# Altium project th0nanoPC.PrjPcb
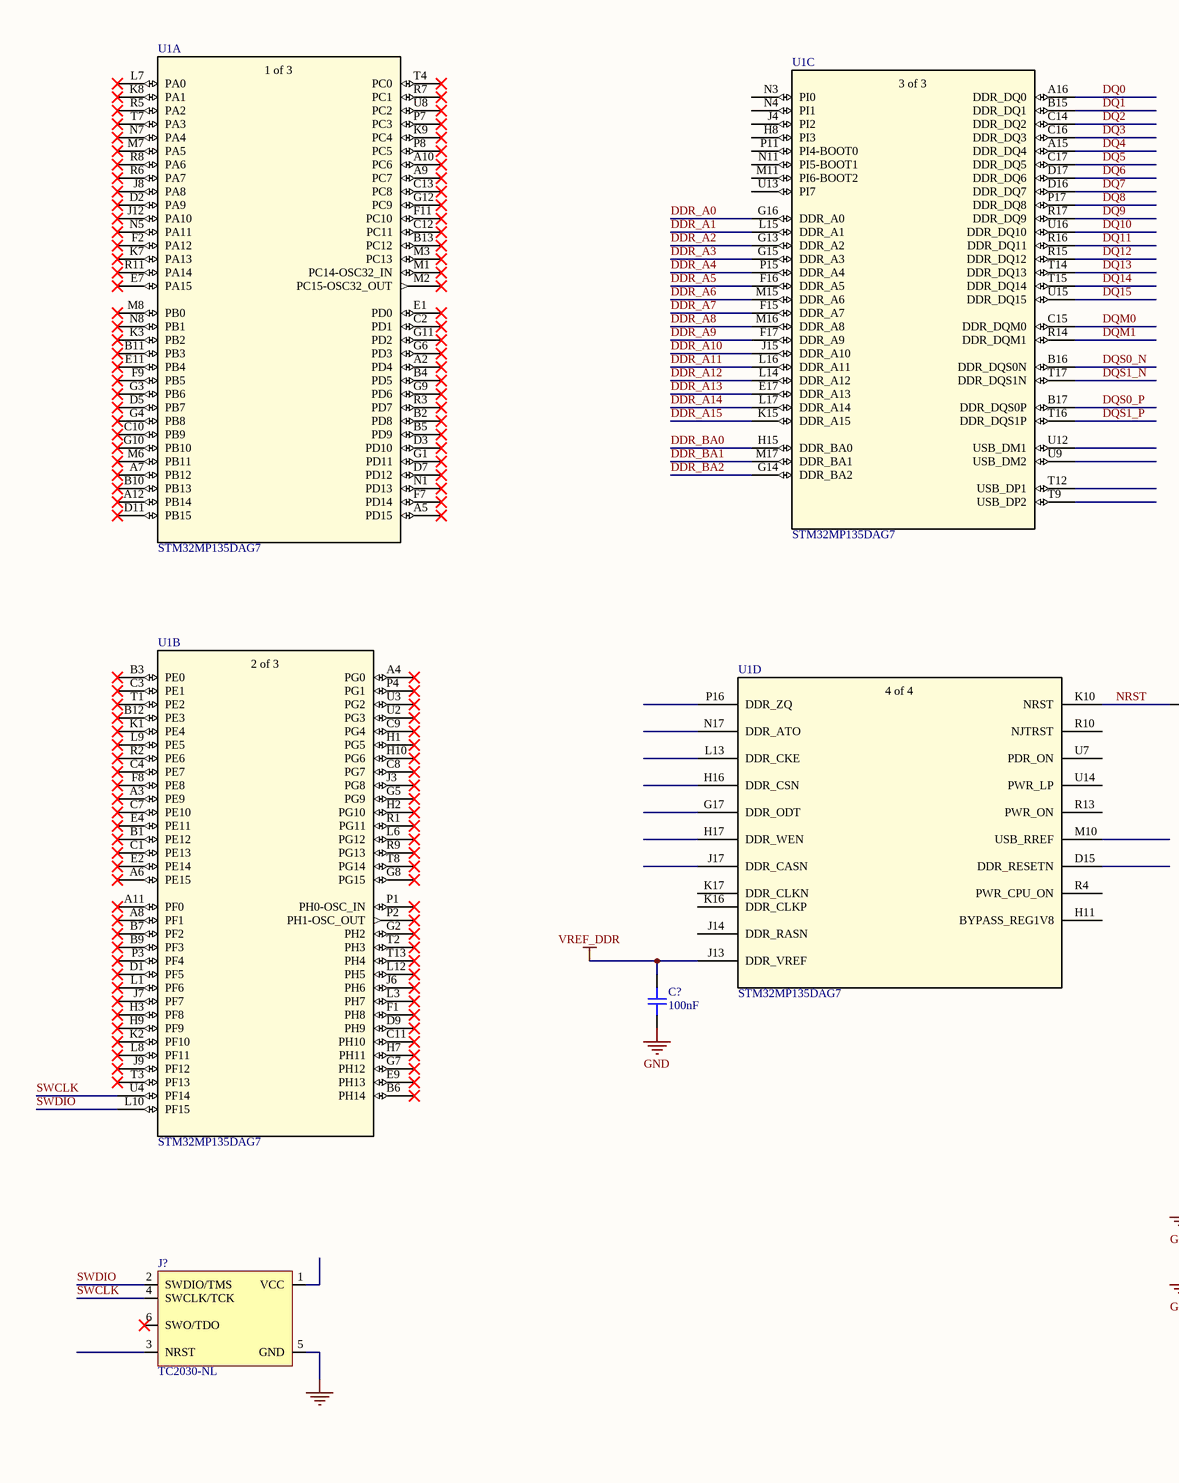
[diagram p0: core.SchDoc, left]
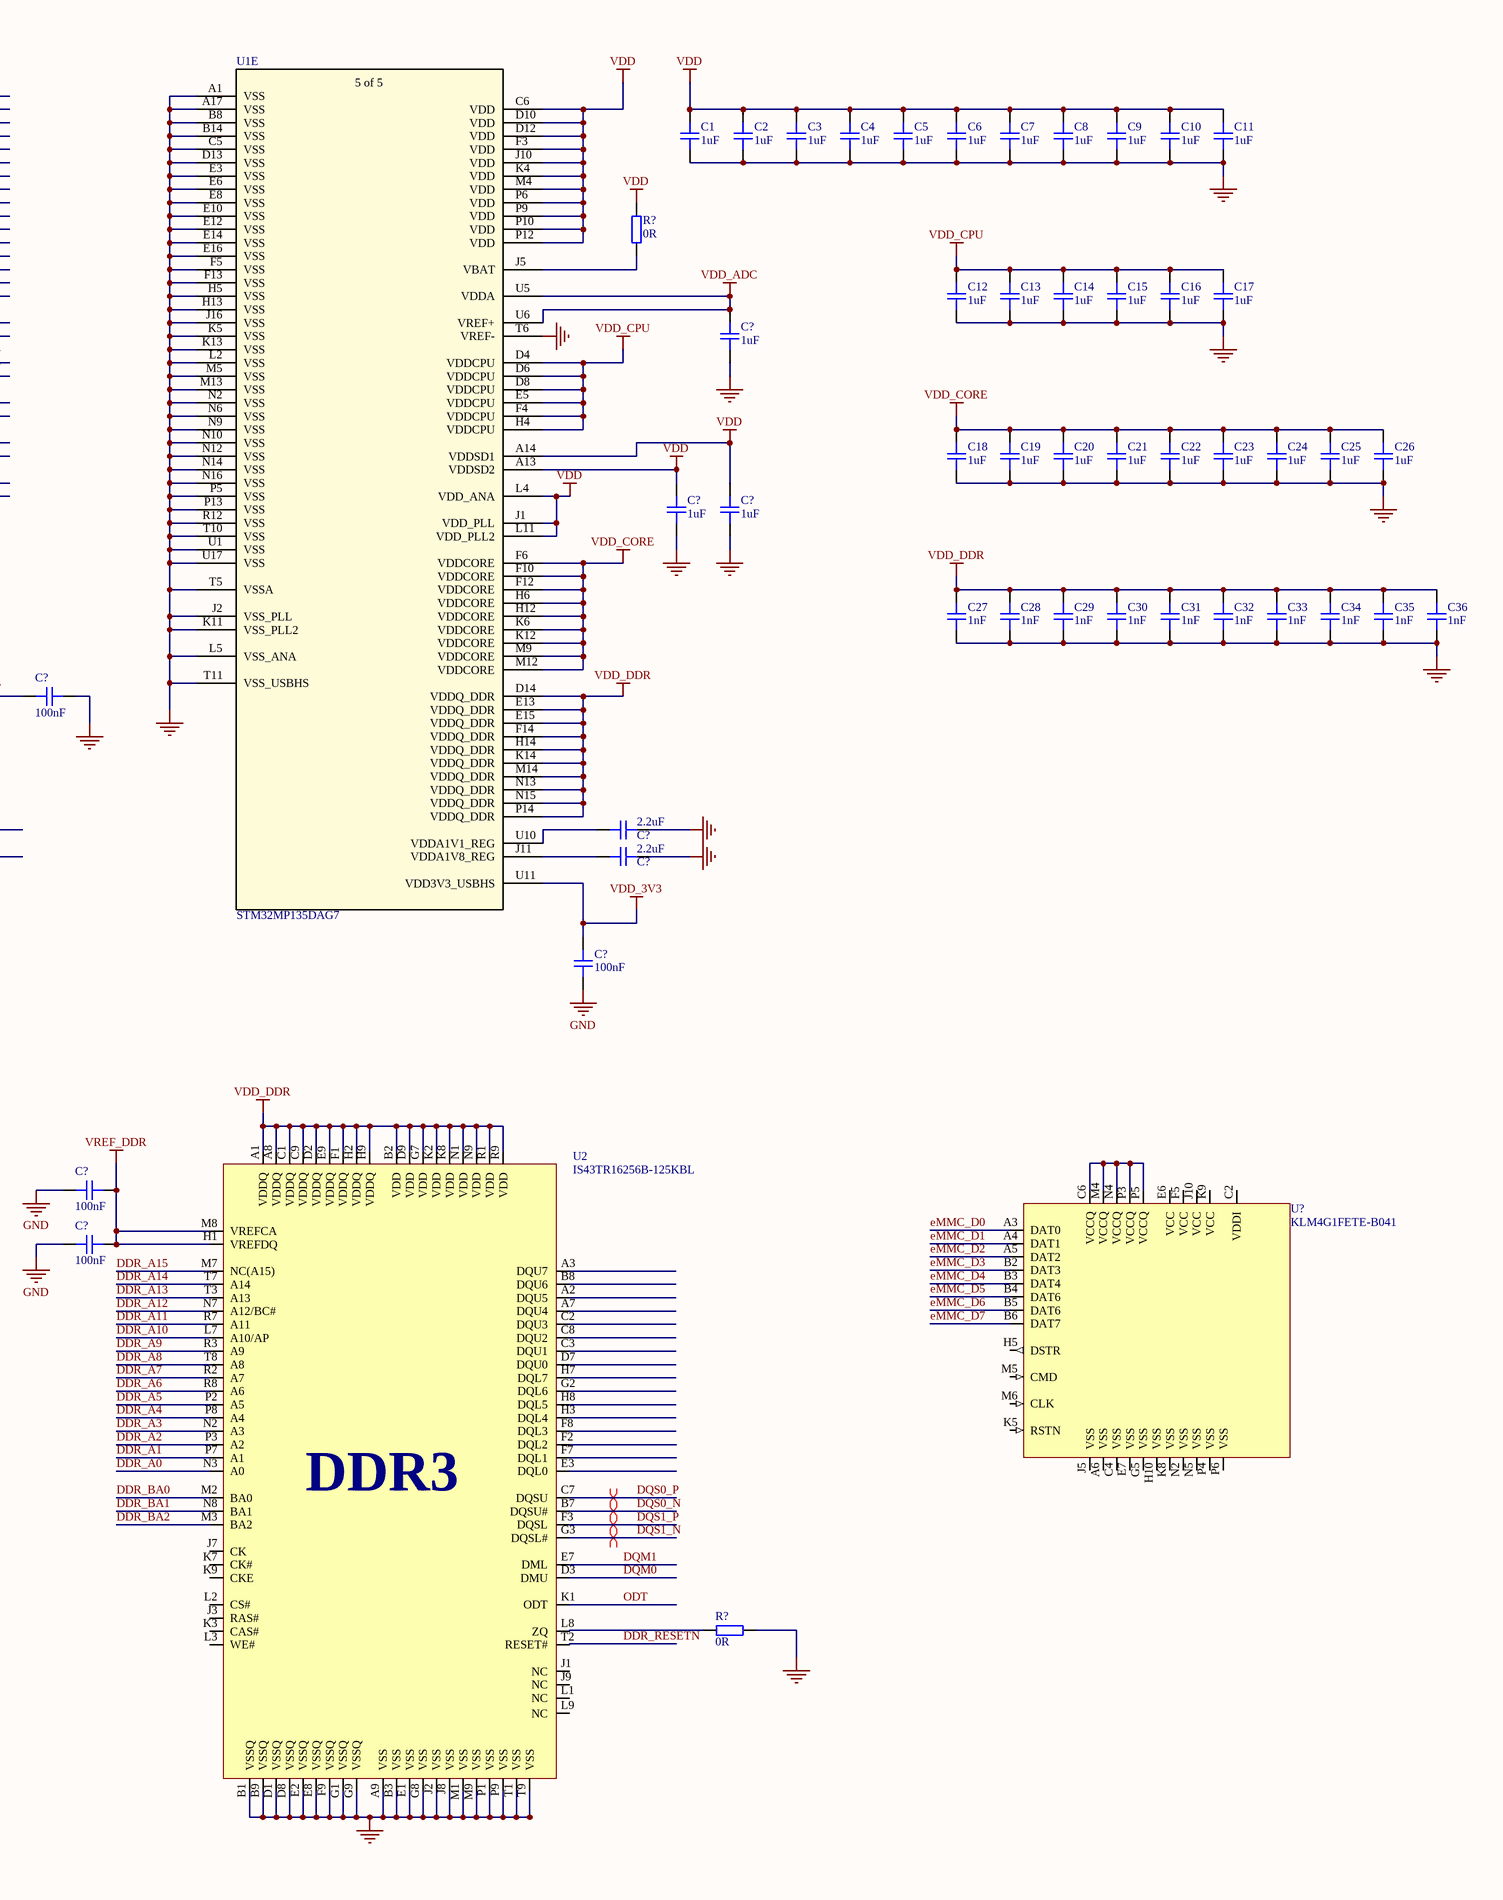
[diagram p1: core.SchDoc, right]
1 sheet, 52 parts. Net scope: global (net labels, ports and power ports of the same name join across sheets).
Board file: TH0A001.PcbDoc

## Sheet core.SchDoc
size A2; SheetNumber: 1; SheetTotal: 1

### Parts
(Parts that share a designator on the sheet are numbered #1, #2 ... from top to bottom, then left to right.)
C1  1uF  [CAP_0402]
C2  1uF  [CAP_0402]
C3  1uF  [CAP_0402]
C4  1uF  [CAP_0402]
C5  1uF  [CAP_0402]
C6  1uF  [CAP_0402]
C7  1uF  [CAP_0402]
C8  1uF  [CAP_0402]
C9  1uF  [CAP_0402]
C10  1uF  [CAP_0402]
C11  1uF  [CAP_0402]
C12  1uF  [CAP_0402]
C13  1uF  [CAP_0402]
C14  1uF  [CAP_0402]
C15  1uF  [CAP_0402]
C16  1uF  [CAP_0402]
C17  1uF  [CAP_0402]
C18  1uF  [CAP_0402]
C19  1uF  [CAP_0402]
C20  1uF  [CAP_0402]
C21  1uF  [CAP_0402]
C22  1uF  [CAP_0402]
C23  1uF  [CAP_0402]
C24  1uF  [CAP_0402]
C25  1uF  [CAP_0402]
C26  1uF  [CAP_0402]
C27  1nF  [CAP_0402]
C28  1nF  [CAP_0402]
C29  1nF  [CAP_0402]
C30  1nF  [CAP_0402]
C31  1nF  [CAP_0402]
C32  1nF  [CAP_0402]
C33  1nF  [CAP_0402]
C34  1nF  [CAP_0402]
C35  1nF  [CAP_0402]
C36  1nF  [CAP_0402]
C?#1  1uF  [CAP_0402]
C?#2  1uF  [CAP_0402]
C?#3  1uF  [CAP_0402]
C?#4  100nF  [CAP_0402]
C?#5  2.2uF  [CAP_0402]
C?#6  2.2uF  [CAP_0402]
C?#7  100nF  [CAP_0402]
C?#8  100nF  [CAP_0402]
C?#9  100nF  [CAP_0402]
C?#10  100nF  [CAP_0402]
J?  TC2030-NL  [TC2030-NL-FP]  (no BOM)
R?#1  0R  [RES_0402]
R?#2  0R  [RES_0402]
U1  STM32MP135DAG7  [TFBGA289_STM]  (parts A,B,C,D,E of 5)
U2  IS43TR16256B-125KBL  [BGA96C80P9X16_900X1300X120]
U?  KLM4G1FETE-B041  [FBGA-153-11X10X0MM8]

### Nets
GND: C1.1 C2.1 C3.1 C4.1 C5.1 C6.1 C7.1 C8.1 C9.1 C10.1 C11.1 C12.1 C13.1 C14.1 C15.1 C16.1 C17.1 C18.1 C19.1 C20.1 C21.1 C22.1 C23.1 C24.1 C25.1 C26.1 C27.1 C28.1 C29.1 C30.1 C31.1 C32.1 C33.1 C34.1 C35.1 C36.1 C?#1.1 C?#2.1 C?#3.1 C?#4.1 C?#5.1 C?#6.1 C?#7.1 C?#8.2 C?#9.2 C?#10.2 J?.5(GND) R?#2.1 U1.A1(VSS) U1.A17(VSS) U1.B8(VSS) U1.B14(VSS) U1.C5(VSS) U1.D13(VSS) U1.E3(VSS) U1.E6(VSS) U1.E8(VSS) U1.E10(VSS) U1.E12(VSS) U1.E14(VSS) U1.E16(VSS) U1.F5(VSS) U1.F13(VSS) U1.H5(VSS) U1.H13(VSS) U1.J2(VSS_PLL) U1.J16(VSS) U1.K5(VSS) U1.K11(VSS_PLL2) U1.K13(VSS) U1.L2(VSS) U1.L5(VSS_ANA) U1.M5(VSS) U1.M13(VSS) U1.N2(VSS) U1.N6(VSS) U1.N9(VSS) U1.N10(VSS) U1.N12(VSS) U1.N14(VSS) U1.N16(VSS) U1.P5(VSS) U1.P13(VSS) U1.R12(VSS) U1.T5(VSSA) U1.T6(VREF-) U1.T10(VSS) U1.T11(VSS_USBHS) U1.U1(VSS) U1.U17(VSS) U2.A9(VSS) U2.B1(VSSQ) U2.B3(VSS) U2.B9(VSSQ) U2.D1(VSSQ) U2.D8(VSSQ) U2.E1(VSS) U2.E2(VSSQ) U2.E8(VSSQ) U2.F9(VSSQ) U2.G1(VSSQ) U2.G8(VSS) U2.G9(VSSQ) U2.J2(VSS) U2.J8(VSS) U2.M1(VSS) U2.M9(VSS) U2.P1(VSS) U2.P9(VSS) U2.T1(VSS) U2.T9(VSS)
VDD: C1.2 C2.2 C3.2 C4.2 C5.2 C6.2 C7.2 C8.2 C9.2 C10.2 C11.2 C?#2.2 C?#3.2 R?#1.2 U1.A13(VDDSD2) U1.A14(VDDSD1) U1.C6(VDD) U1.D10(VDD) U1.D12(VDD) U1.F3(VDD) U1.J1(VDD_PLL) U1.J10(VDD) U1.K4(VDD) U1.L4(VDD_ANA) U1.L11(VDD_PLL2) U1.M4(VDD) U1.P6(VDD) U1.P9(VDD) U1.P10(VDD) U1.P12(VDD)
VDD_3V3: C?#7.2 U1.U11(VDD3V3_USBHS)
VDD_ADC: C?#1.2 U1.U5(VDDA) U1.U6(VREF+)
VDD_CORE: C18.2 C19.2 C20.2 C21.2 C22.2 C23.2 C24.2 C25.2 C26.2 U1.F6(VDDCORE) U1.F10(VDDCORE) U1.F12(VDDCORE) U1.H6(VDDCORE) U1.H12(VDDCORE) U1.K6(VDDCORE) U1.K12(VDDCORE) U1.M9(VDDCORE) U1.M12(VDDCORE)
VDD_CPU: C12.2 C13.2 C14.2 C15.2 C16.2 C17.2 U1.D4(VDDCPU) U1.D6(VDDCPU) U1.D8(VDDCPU) U1.E5(VDDCPU) U1.F4(VDDCPU) U1.H4(VDDCPU)
VDD_DDR: C27.2 C28.2 C29.2 C30.2 C31.2 C32.2 C33.2 C34.2 C35.2 C36.2 U1.D14(VDDQ_DDR) U1.E13(VDDQ_DDR) U1.E15(VDDQ_DDR) U1.F14(VDDQ_DDR) U1.H14(VDDQ_DDR) U1.K14(VDDQ_DDR) U1.M14(VDDQ_DDR) U1.N13(VDDQ_DDR) U1.N15(VDDQ_DDR) U1.P14(VDDQ_DDR) U2.A1(VDDQ) U2.A8(VDDQ) U2.B2(VDD) U2.C1(VDDQ) U2.C9(VDDQ) U2.D2(VDDQ) U2.D9(VDD) U2.E9(VDDQ) U2.F1(VDDQ) U2.G7(VDD) U2.H2(VDDQ) U2.H9(VDDQ) U2.K2(VDD) U2.K8(VDD) U2.N1(VDD) U2.N9(VDD) U2.R1(VDD) U2.R9(VDD)
VREF_DDR: C?#8.1 C?#9.1 C?#10.1 U1.J13(DDR_VREF) U2.H1(VREFDQ) U2.M8(VREFCA)
DDR_A0: U1.G16(DDR_A0) U2.N3(A0)
DDR_A1: U1.L15(DDR_A1) U2.P7(A1)
DDR_A2: U1.G13(DDR_A2) U2.P3(A2)
DDR_A3: U1.G15(DDR_A3) U2.N2(A3)
DDR_A4: U1.P15(DDR_A4) U2.P8(A4)
DDR_A5: U1.F16(DDR_A5) U2.P2(A5)
DDR_A6: U1.M15(DDR_A6) U2.R8(A6)
DDR_A7: U1.F15(DDR_A7) U2.R2(A7)
DDR_A8: U1.M16(DDR_A8) U2.T8(A8)
DDR_A9: U1.F17(DDR_A9) U2.R3(A9)
DDR_A10: U1.J15(DDR_A10) U2.L7(A10/AP)
DDR_A11: U1.L16(DDR_A11) U2.R7(A11)
DDR_A12: U1.L14(DDR_A12) U2.N7(A12/BC#)
DDR_A13: U1.E17(DDR_A13) U2.T3(A13)
DDR_A14: U1.L17(DDR_A14) U2.T7(A14)
DDR_A15: U1.K15(DDR_A15) U2.M7(NC(A15))
DDR_BA0: U1.H15(DDR_BA0) U2.M2(BA0)
DDR_BA1: U1.M17(DDR_BA1) U2.N8(BA1)
DDR_BA2: U1.G14(DDR_BA2) U2.M3(BA2)
DDR_RESETN: U2.T2(RESET#)
DQ0: U1.A16(DDR_DQ0)
DQ1: U1.B15(DDR_DQ1)
DQ2: U1.C14(DDR_DQ2)
DQ3: U1.C16(DDR_DQ3)
DQ4: U1.A15(DDR_DQ4)
DQ5: U1.C17(DDR_DQ5)
DQ6: U1.D17(DDR_DQ6)
DQ7: U1.D16(DDR_DQ7)
DQ8: U1.P17(DDR_DQ8)
DQ9: U1.R17(DDR_DQ9)
DQ10: U1.U16(DDR_DQ10)
DQ11: U1.R16(DDR_DQ11)
DQ12: U1.R15(DDR_DQ12)
DQ13: U1.T14(DDR_DQ13)
DQ14: U1.T15(DDR_DQ14)
DQ15: U1.U15(DDR_DQ15)
DQM0: U1.C15(DDR_DQM0) U2.D3(DMU)
DQM1: U1.R14(DDR_DQM1) U2.E7(DML)
DQS0_N: U1.B16(DDR_DQS0N) U2.B7(DQSU#)
DQS0_P: U1.B17(DDR_DQS0P) U2.C7(DQSU)
DQS1_N: U1.T17(DDR_DQS1N) U2.G3(DQSL#)
DQS1_P: U1.T16(DDR_DQS1P) U2.F3(DQSL)
eMMC_D0: U?.A3(DAT0)
eMMC_D1: U?.A4(DAT1)
eMMC_D2: U?.A5(DAT2)
eMMC_D3: U?.B2(DAT3)
eMMC_D4: U?.B3(DAT4)
eMMC_D5: U?.B4(DAT6)
eMMC_D6: U?.B5(DAT6)
eMMC_D7: U?.B6(DAT7)
NRST: C?#4.2 U1.K10(NRST)
ODT: U2.K1(ODT)
SWCLK: J?.4(SWCLK/TCK) U1.U4(PF14)
SWDIO: J?.2(SWDIO/TMS) U1.L10(PF15)
NetC?#5_2: C?#5.2 U1.U10(VDDA1V1_REG)
NetC?#6_2: C?#6.2 U1.J11(VDDA1V8_REG)
NetR?#1_1: R?#1.1 U1.J5(VBAT)
NetR?#2_2: R?#2.2 U2.L8(ZQ)
NetU?_C6: U?.C6(VCCQ) U?.M4(VCCQ) U?.N4(VCCQ) U?.P3(VCCQ) U?.P5(VCCQ)

Not connected (* = marked no-connect by the designer): J? 1(VCC) 3(NRST) 6(SWO/TDO)*; U1 A2(PD4)* A3(PE9)* A4(PG0)* A5(PD15)* A6(PE15)* A7(PB12)* A8(PF1)* A9(PC7)* A10(PC6)* A11(PF0)* A12(PB14)* B1(PE12)* B2(PD8)* B3(PE0)* B4(PD5)* B5(PD9)* B6(PH14)* B7(PF2)* B9(PF3)* B10(PB13)* B11(PB3)* B12(PE3)* B13(PC12)* C1(PE13)* C2(PD1)* C3(PE1)* C4(PE7)* C7(PE10)* C8(PG7)* C9(PG4)* C10(PB9)* C11(PH10)* C12(PC11)* C13(PC8)* D1(PF5)* D2(PA9)* D3(PD10)* D5(PB7)* D7(PD12)* D9(PH9)* D11(PB15)* D15(DDR_RESETN) E1(PD0)* E2(PE14)* E4(PE11)* E7(PA15)* E9(PH13)* E11(PB4)* F1(PH8)* F2(PA12)* F7(PD14)* F8(PE8)* F9(PB5)* F11(PC10)* G1(PD11)* G2(PH2)* G3(PB6)* G4(PB8)* G5(PG9)* G6(PD3)* G7(PH12)* G8(PG15)* G9(PD6)* G10(PB10)* G11(PD2)* G12(PC9)* G17(DDR_ODT) H1(PG5)* H2(PG10)* H3(PF8)* H7(PH11)* H8(PI3) H9(PF9)* H10(PG6)* H11(BYPASS_REG1V8) H16(DDR_CSN) H17(DDR_WEN) J3(PG8)* J4(PI2) J6(PH6)* J7(PF7)* J8(PA8)* J9(PF12)* J12(PA10)* J14(DDR_RASN) J17(DDR_CASN) K1(PE4)* K2(PF10)* K3(PB2)* K7(PA13)* K8(PA1)* K9(PC4)* K16(DDR_CLKP) K17(DDR_CLKN) L1(PF6)* L3(PH7)* L6(PG12)* L7(PA0)* L8(PF11)* L9(PE5)* L12(PH5)* L13(DDR_CKE) M1(PC14-OSC32_IN)* M2(PC15-OSC32_OUT)* M3(PC13)* M6(PB11)* M7(PA5)* M8(PB0)* M10(USB_RREF) M11(PI6-BOOT2) N1(PD13)* N3(PI0) N4(PI1) N5(PA11)* N7(PA4)* N8(PB1)* N11(PI5-BOOT1) N17(DDR_ATO) P1(PH0-OSC_IN)* P2(PH1-OSC_OUT)* P3(PF4)* P4(PG1)* P7(PC3)* P8(PC5)* P11(PI4-BOOT0) P16(DDR_ZQ) R1(PG11)* R2(PE6)* R3(PD7)* R4(PWR_CPU_ON) R5(PA2)* R6(PA7)* R7(PC1)* R8(PA6)* R9(PG13)* R10(NJTRST) R11(PA14)* R13(PWR_ON) T1(PE2)* T2(PH3)* T3(PF13)* T4(PC0)* T7(PA3)* T8(PG14)* T9(USB_DP2) T12(USB_DP1) T13(PH4)* U2(PG3)* U3(PG2)* U7(PDR_ON) U8(PC2)* U9(USB_DM2) U12(USB_DM1) U13(PI7) U14(PWR_LP); U2 A2(DQU5) A3(DQU7) A7(DQU4) B8(DQU6) C2(DQU3) C3(DQU1) C8(DQU2) D7(DQU0) E3(DQL0) F2(DQL2) F7(DQL1) F8(DQL3) G2(DQL6) H3(DQL4) H7(DQL7) H8(DQL5) J1(NC) J3(RAS#) J7(CK) J9(NC) K3(CAS#) K7(CK#) K9(CKE) L1(NC) L2(CS#) L3(WE#) L9(NC); U? A6(VSS) C2(VDDI) C4(VSS) E6(VCC) E7(VSS) F5(VCC) G5(VSS) H5(DSTR) H10(VSS) J5(VSS) J10(VCC) K5(RSTN) K8(VSS) K9(VCC) M5(CMD) M6(CLK) N2(VSS) N5(VSS) P4(VSS) P6(VSS)

### Layout directives
differential pair: DQS0_N, DQS0_P, DQS1_N, DQS1_P

### Notes on the sheet
- (in symbol IS43TR16256B-125KBL) DDR3
- (in symbol STM32MP135DAG7, part A) 1 of 3
- (in symbol STM32MP135DAG7, part B) 2 of 3
- (in symbol STM32MP135DAG7, part C) 3 of 3
- (in symbol STM32MP135DAG7, part D) 4 of 4
- (in symbol STM32MP135DAG7, part E) 5 of 5

### Library data of the parts
C1-C36 C?#1-C?#10 = CAP_0402_16V: Capacitor SMD 0402 16V
J? = TC2030-NL: Tag-Connect No-Solder SWD Debug Connector (No Legs) DO NOT PLACE; Manufacturer: Tag-Connect; Manufacturer Part Number: TC2030-NL-FP
R?#1 R?#2 = RES_0402: Resistor SMD 0402; Manufacturer: *; Manufacturer Part Number: *; Distributor Link: *
U1 = STM32MP135DAG7: No Description Available; Mfr_Name: STMicroelectronics; Copyright: Copyright (C) 2024 Ultra Librarian. All rights reserved.; Manufacturer_Part_Number: STM32MP135DAG7; RefDes: RefDes; Type: DEV
U2 = IS43TR16256B-125KBL: DRAM 4GBit, 1.5V, DDR3, 256Mx16, 1600MT/s @ 11-11-11, 96 ball BGA (9mm x13mm) RoHS; Manufacturer: ISSI; Manufacturer Part Number: IS43TR16256B-125KBL
U? = KLM4G1FETE-B041: 4GB eMMC 8-bit memory FBGA-153; Manufacturer: Samsung; Manufacturer Part Number: KLM4G1FETE-B041; LCSC: C500273; Distributor Link: https://www.lcsc.com/product-detail/eMMC_Samsung-KLM4G1FETE-B041_C500273.html